# Altium schematic sheet DIGITAL.SchDoc
size 229 x 299 mm
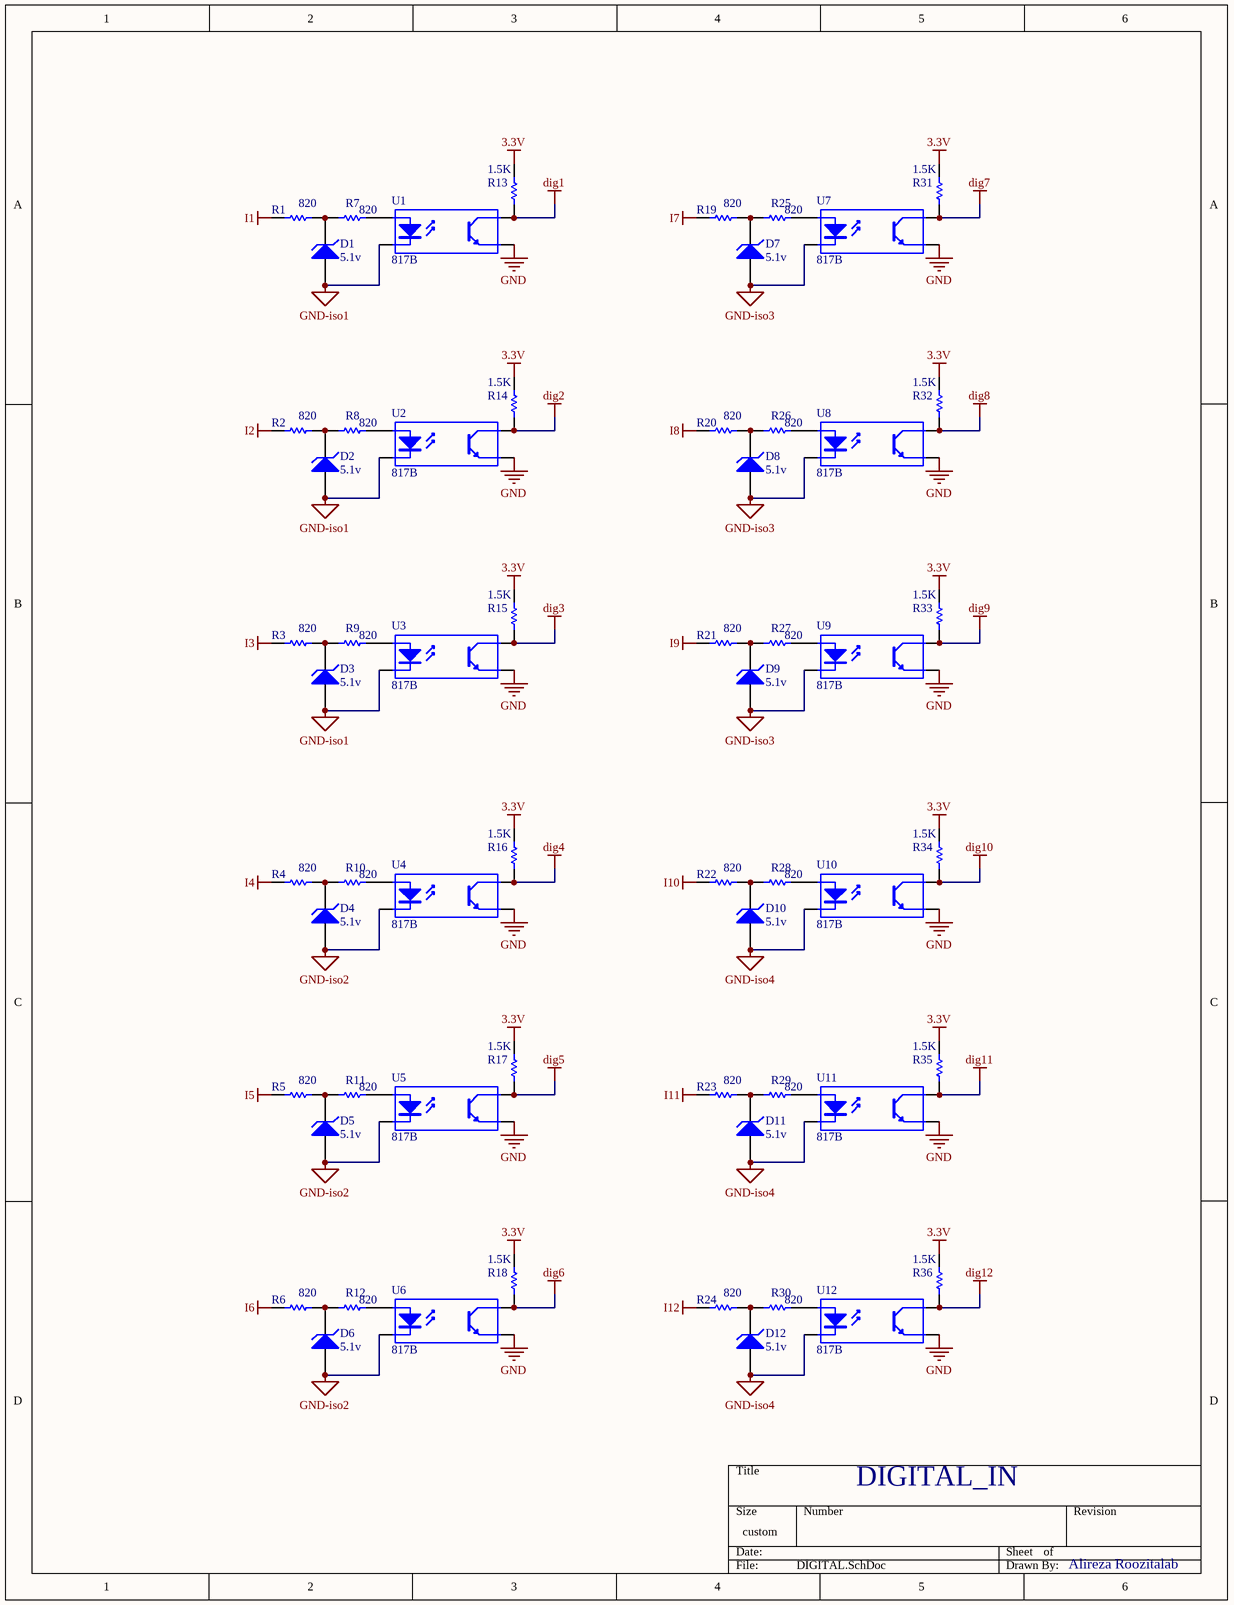
[diagram p0: DIGITAL.SchDoc]

## Parts
D1  5.1v  [Diode-1n4148 - SMD PAD]
D2  5.1v  [Diode-1n4148 - SMD PAD]
D3  5.1v  [Diode-1n4148 - SMD PAD]
D4  5.1v  [Diode-1n4148 - SMD PAD]
D5  5.1v  [Diode-1n4148 - SMD PAD]
D6  5.1v  [Diode-1n4148 - SMD PAD]
D7  5.1v  [Diode-1n4148 - SMD PAD]
D8  5.1v  [Diode-1n4148 - SMD PAD]
D9  5.1v  [Diode-1n4148 - SMD PAD]
D10  5.1v  [Diode-1n4148 - SMD PAD]
D11  5.1v  [Diode-1n4148 - SMD PAD]
D12  5.1v  [Diode-1n4148 - SMD PAD]
R1  value 820  [RES 1206 (3216X08L)]  (hidden comment: Res Semi)
R2  value 820  [RES 1206 (3216X08L)]  (hidden comment: Res Semi)
R3  value 820  [RES 1206 (3216X08L)]  (hidden comment: Res Semi)
R4  value 820  [RES 1206 (3216X08L)]  (hidden comment: Res Semi)
R5  value 820  [RES 1206 (3216X08L)]  (hidden comment: Res Semi)
R6  value 820  [RES 1206 (3216X08L)]  (hidden comment: Res Semi)
R7  value 820  [RES 1206 (3216X08L)]  (hidden comment: Res Semi)
R8  value 820  [RES 1206 (3216X08L)]  (hidden comment: Res Semi)
R9  value 820  [RES 1206 (3216X08L)]  (hidden comment: Res Semi)
R10  value 820  [RES 1206 (3216X08L)]  (hidden comment: Res Semi)
R11  value 820  [RES 1206 (3216X08L)]  (hidden comment: Res Semi)
R12  value 820  [RES 1206 (3216X08L)]  (hidden comment: Res Semi)
R13  value 1.5K  [RES 1206 (3216X08L)]  (hidden comment: Res Semi)
R14  value 1.5K  [RES 1206 (3216X08L)]  (hidden comment: Res Semi)
R15  value 1.5K  [RES 1206 (3216X08L)]  (hidden comment: Res Semi)
R16  value 1.5K  [RES 1206 (3216X08L)]  (hidden comment: Res Semi)
R17  value 1.5K  [RES 1206 (3216X08L)]  (hidden comment: Res Semi)
R18  value 1.5K  [RES 1206 (3216X08L)]  (hidden comment: Res Semi)
R19  value 820  [RES 1206 (3216X08L)]  (hidden comment: Res Semi)
R20  value 820  [RES 1206 (3216X08L)]  (hidden comment: Res Semi)
R21  value 820  [RES 1206 (3216X08L)]  (hidden comment: Res Semi)
R22  value 820  [RES 1206 (3216X08L)]  (hidden comment: Res Semi)
R23  value 820  [RES 1206 (3216X08L)]  (hidden comment: Res Semi)
R24  value 820  [RES 1206 (3216X08L)]  (hidden comment: Res Semi)
R25  value 820  [RES 1206 (3216X08L)]  (hidden comment: Res Semi)
R26  value 820  [RES 1206 (3216X08L)]  (hidden comment: Res Semi)
R27  value 820  [RES 1206 (3216X08L)]  (hidden comment: Res Semi)
R28  value 820  [RES 1206 (3216X08L)]  (hidden comment: Res Semi)
R29  value 820  [RES 1206 (3216X08L)]  (hidden comment: Res Semi)
R30  value 820  [RES 1206 (3216X08L)]  (hidden comment: Res Semi)
R31  value 1.5K  [RES 1206 (3216X08L)]  (hidden comment: Res Semi)
R32  value 1.5K  [RES 1206 (3216X08L)]  (hidden comment: Res Semi)
R33  value 1.5K  [RES 1206 (3216X08L)]  (hidden comment: Res Semi)
R34  value 1.5K  [RES 1206 (3216X08L)]  (hidden comment: Res Semi)
R35  value 1.5K  [RES 1206 (3216X08L)]  (hidden comment: Res Semi)
R36  value 1.5K  [RES 1206 (3216X08L)]  (hidden comment: Res Semi)
U1  817B  [DIP+4]
U2  817B  [DIP+4]
U3  817B  [DIP+4]
U4  817B  [DIP+4]
U5  817B  [DIP+4]
U6  817B  [DIP+4]
U7  817B  [DIP+4]
U8  817B  [DIP+4]
U9  817B  [DIP+4]
U10  817B  [DIP+4]
U11  817B  [DIP+4]
U12  817B  [DIP+4]

## Nets
3.3V: R13.2 R14.2 R15.2 R16.2 R17.2 R18.2 R31.2 R32.2 R33.2 R34.2 R35.2 R36.2
dig1: R13.1 U1.4(C)
dig2: R14.1 U2.4(C)
dig3: R15.1 U3.4(C)
dig4: R16.1 U4.4(C)
dig5: R17.1 U5.4(C)
dig6: R18.1 U6.4(C)
dig7: R31.1 U7.4(C)
dig8: R32.1 U8.4(C)
dig9: R33.1 U9.4(C)
dig10: R34.1 U10.4(C)
dig11: R35.1 U11.4(C)
dig12: R36.1 U12.4(C)
GND: U1.3(E) U2.3(E) U3.3(E) U4.3(E) U5.3(E) U6.3(E) U7.3(E) U8.3(E) U9.3(E) U10.3(E) U11.3(E) U12.3(E)
GND-iso1: D1.1(A) D2.1(A) D3.1(A) U1.2(K) U2.2(K) U3.2(K)
GND-iso2: D4.1(A) D5.1(A) D6.1(A) U4.2(K) U5.2(K) U6.2(K)
GND-iso3: D7.1(A) D8.1(A) D9.1(A) U7.2(K) U8.2(K) U9.2(K)
GND-iso4: D10.1(A) D11.1(A) D12.1(A) U10.2(K) U11.2(K) U12.2(K)
I1: R1.1
I2: R2.1
I3: R3.1
I4: R4.1
I5: R5.1
I6: R6.1
I7: R19.1
I8: R20.1
I9: R21.1
I10: R22.1
I11: R23.1
I12: R24.1
NetD1_2: D1.2(K) R1.2 R7.1
NetD2_2: D2.2(K) R2.2 R8.1
NetD3_2: D3.2(K) R3.2 R9.1
NetD4_2: D4.2(K) R4.2 R10.1
NetD5_2: D5.2(K) R5.2 R11.1
NetD6_2: D6.2(K) R6.2 R12.1
NetD7_2: D7.2(K) R19.2 R25.1
NetD8_2: D8.2(K) R20.2 R26.1
NetD9_2: D9.2(K) R21.2 R27.1
NetD10_2: D10.2(K) R22.2 R28.1
NetD11_2: D11.2(K) R23.2 R29.1
NetD12_2: D12.2(K) R24.2 R30.1
NetR7_2: R7.2 U1.1(A)
NetR8_2: R8.2 U2.1(A)
NetR9_2: R9.2 U3.1(A)
NetR10_2: R10.2 U4.1(A)
NetR11_2: R11.2 U5.1(A)
NetR12_2: R12.2 U6.1(A)
NetR25_2: R25.2 U7.1(A)
NetR26_2: R26.2 U8.1(A)
NetR27_2: R27.2 U9.1(A)
NetR28_2: R28.2 U10.1(A)
NetR29_2: R29.2 U11.1(A)
NetR30_2: R30.2 U12.1(A)

## Notes on the sheet
- DIGITAL_IN
- Alireza Roozitalab

## Library data of the parts
D1-D12 = D Zener: Zener Diode; Published: 8-Jun-2000; LatestRevisionDate: 17-Jul-2002; LatestRevisionNote: Re-released for DXP Platform.; PackageReference: DIODE-0.7; Publisher: Altium Limited
R1-R36 = Res Semi: Semiconductor Resistor; Published: 8-Jun-2000; LatestRevisionDate: 17-Jul-2002; LatestRevisionNote: Re-released for DXP Platform.; PackageReference: AXIAL-0.5; Publisher: Altium Limited
U1-U12 = Optoisolator1: 4-Pin Phototransistor Optocoupler; Published: 24-Mar-1999; LatestRevisionDate: 04-Mar-2005; LatestRevisionNote: Sch pins 3 & 4 Swapped.; DatasheetDocument: Nov-2003; PackageReference: DIP-4; Publisher: Altium Limited